# EAGLE design thermostat (EAGLE 7.2.0)
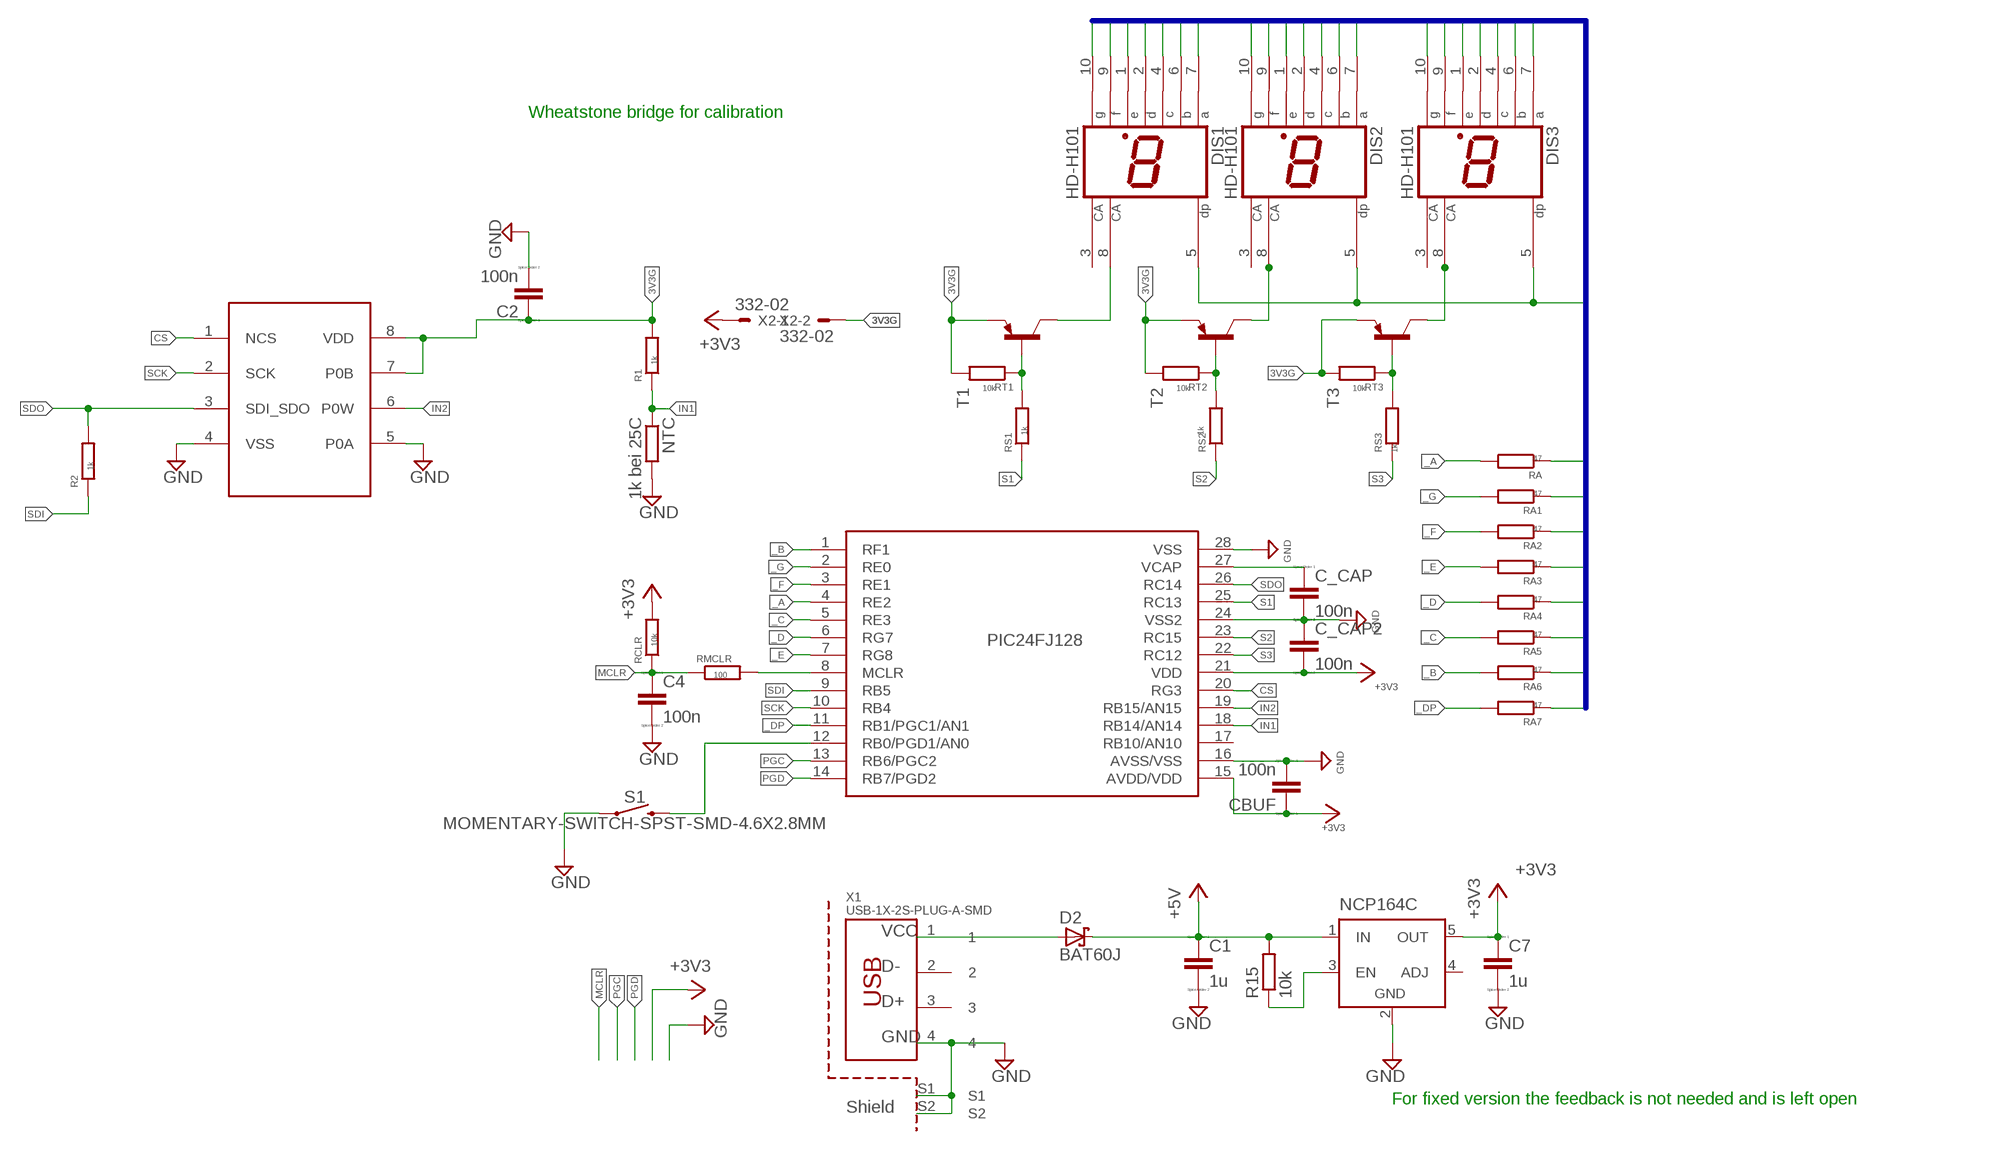
[diagram p0: schematic, sheet 1]

## Parts
C1  1u  CC0603  [C0603]
C2  100n  CC0603  [C0603]
C4  100n  CC0603  [C0603]
C7  1u  CC0603  [C0603]
C_CAP  100n  CC0603  [C0603]
C_CAP2  100n  CC0603  [C0603]
CBUF  100n  CC0603  [C0603]
D2  BAT60J  [SOD323_ST]
DIS1  HD-H101  [HDSP-M]
DIS2  HD-H101  [HDSP-M]
DIS3  HD-H101  [HDSP-M]
NCP164C  -  NCP164C-5V-3.3V  [TSOP-5]
NTC  1k bei 25C  R-EU_0204/2V  [0204V]
R1  1k  R-EU_R0603  [R0603]
R2  1k  R-EU_R0603  [R0603]
R15  10k  R-EU_R0603  [R0603]
RA  47  R-EU_R0603  [R0603]
RA1  47  R-EU_R0603  [R0603]
RA2  47  R-EU_R0603  [R0603]
RA3  47  R-EU_R0603  [R0603]
RA4  47  R-EU_R0603  [R0603]
RA5  47  R-EU_R0603  [R0603]
RA6  47  R-EU_R0603  [R0603]
RA7  47  R-EU_R0603  [R0603]
RCLR  10k  R-EU_R0603  [R0603]
RMCLR  100  R-EU_R0603  [R0603]
RS1  1k  R-EU_R0603  [R0603]
RS2  1k  R-EU_R0603  [R0603]
RS3  1k  R-EU_R0603  [R0603]
RT1  10k  R-EU_R0603  [R0603]
RT2  10k  R-EU_R0603  [R0603]
RT3  10k  R-EU_R0603  [R0603]
S1  MOMENTARY-SWITCH-SPST-SMD-4.6X2.8MM  [TACTILE_SWITCH_SMD_4.6X2.8MM]
T1  -PNP-SOT23-BCE  [SOT23-BCE]
T2  -PNP-SOT23-BCE  [SOT23-BCE]
T3  -PNP-SOT23-BCE  [SOT23-BCE]
U$1  MCP4151  [SO-08]
U$2  -  PIC24FJ128  [SSOP28]
X1  USB-1X-2S-PLUG-A-SMD  [USB-PLUG-A-SMD-2S]
X2  332-02  [332-02]

## Nets
3V3G: C2.1 R1.2 RT1.2 RT2.2 RT3.2 T1.E T2.E T3.E U$1.7(P0B) U$1.8(VDD) X2.2
+3V3: C7.1 C_CAP2.2 CBUF.1 NCP164C.5(OUT) RCLR.2 U$2.15(AVDD/VDD) U$2.21(VDD) X2.1
+5V: C1.1 D2.C NCP164C.1(IN) R15.2
_A: RA.2 U$2.4(RE2)
_B: RA6.2 U$2.1(RF1)
_C: RA5.2 U$2.5(RE3)
_D: RA4.2 U$2.6(RG7)
_DP: RA7.2 U$2.11(RB1/PGC1/AN1)
_E: RA3.2 U$2.7(RG8)
_F: RA2.2 U$2.3(RE1)
_G: RA1.2 U$2.2(RE0)
A: DIS1.7(A) DIS2.7(A) DIS3.7(A) RA.1
B: DIS1.6(B) DIS2.6(B) DIS3.6(B) RA6.1
C: DIS1.4(C) DIS2.4(C) DIS3.4(C) RA5.1
CS: U$1.1(NCS) U$2.20(RG3)
D: DIS1.2(D) DIS2.2(D) DIS3.2(D) RA4.1
DP: DIS1.5(DP) DIS2.5(DP) DIS3.5(DP) RA7.1
E: DIS1.1(E) DIS2.1(E) DIS3.1(E) RA3.1
F: DIS1.9(F) DIS2.9(F) DIS3.9(F) RA2.1
G: DIS1.10(G) DIS2.10(G) DIS3.10(G) RA1.1
GND: C1.2 C2.2 C4.2 C7.2 C_CAP2.1 C_CAP.2 CBUF.2 NCP164C.2(GND) NTC.2 S1.1 S1.2 U$1.4(VSS) U$1.5(P0A) U$2.16(AVSS/VSS) U$2.24(VSS2) U$2.28(VSS) X1.4 X1.S1 X1.S2
IN1: NTC.1 R1.1 U$2.18(RB14/AN14)
IN2: U$1.6(P0W) U$2.19(RB15/AN15)
MCLR: C4.1 RCLR.1 RMCLR.1
N$1: NCP164C.3(EN) R15.1
N$4: C_CAP.1 U$2.27(VCAP)
N$5: RS1.2 RT1.1 T1.B
N$6: D2.A X1.1
N$8: RMCLR.2 U$2.8(MCLR)
N$12: RS3.2 RT3.1 T3.B
N$14: RS2.2 RT2.1 T2.B
N$16: DIS1.8(CA) T1.C
N$17: DIS2.8(CA) T2.C
N$18: DIS3.8(CA) T3.C
N$30: S1.3 S1.4 U$2.12(RB0/PGD1/AN0)
PGC: U$2.13(RB6/PGC2)
PGD: U$2.14(RB7/PGD2)
S1: RS1.1 U$2.25(RC13)
S2: RS2.1 U$2.23(RC15)
S3: RS3.1 U$2.22(RC12)
SCK: U$1.2(SCK) U$2.10(RB4)
SDI: R2.1 U$2.9(RB5)
SDO: R2.2 U$1.3(SDI_SDO) U$2.26(RC14)
Unconnected: DIS1.3(CA) DIS2.3(CA) DIS3.3(CA) NCP164C.4(ADJ) U$2.17(RB10/AN10) X1.2 X1.3

## Buses
A,B,C,D,E,F,G,DP

## Notes on the sheet
- Wheatstone bridge for calibration
- For fixed version the feedback is not needed and is left open

## Library data of the parts
C1 C2 C4 C7 C_CAP C_CAP2 CBUF = eagle-ltspice:C: CAPACITOR, European symbol; SPICEMODEL: NONE; SPICEPREFIX: C
D2 = diode:BAT60J: Schottky barrier diode Source: www.st.com, BAT60J.pdf
DIS1-DIS3 = display-hp:HD-H101: LED DISPLAY 1-character 7 segment, decimal point right; OC_FARNELL: unknown; OC_NEWARK: unknown
NCP164C = linear:NCP164C-5V-3.3V
NTC = resistor:R-EU_: RESISTOR, European symbol
R1 R2 R15 RA RA1-RA7 RCLR RMCLR RS1-RS3 RT1-RT3 = rcl:R-EU_: RESISTOR, European symbol
S1 = SparkFun-Switches:MOMENTARY-SWITCH-SPST: Momentary Switch (Pushbutton) - SPST Normally-open (NO) SPST momentary switches (buttons, pushbuttons). Variants PTH-12MM - 12mm square, through-hole Momentary Pushbutton Switch - 12mm Square <https://www.sparkfun.com/products/9190> (COM-09190) PTH-6.0MM, PTH-6.0MM-KIT - 6.0mm square, through-hole Mini Pushbutton Switch <https://www.sparkfun.com/products/97> (COM-00097) KIT package intended for soldering kit's - only one side of pads' copper is exposed. PTH-RIGHT-ANGLE-KIT - Right-angle, through-hole Right Angle Tactile Button <https://www.sparkfun.com/products/10791> - Used on SparkFun BigTime Watch Kit <https://www.sparkfun.com/products/11734> SMD-12MM - 12mm square, surface-mount Tactile Button - SMD (12mm) <https://www.sparkfun.com/products/12993> (COM-12993) Used on SparkFun PicoBoard <https://www.sparkfun.com/products/11888> SMD-4.5MM - 4.5mm Square Trackball Switch Used on SparkFun Blackberry Trackballer Breakout <https://www.sparkfun.com/products/13169> SMD-4.6MMX2.8MM - 4.60mm x 2.80mm, surface mount Used on SparkFun Pro Micro - RP2040 <https://www.sparkfun.com/products/17717> SMD-5.2MM, SMD-5.2-REDUNDANT - 5.2mm square, surface-mount Mini Pushbutton Switch - SMD <https://www.sparkfun.com/products/8720> (COM-08720) Used on Arduino Pro Mini <https://www.sparkfun.com/products/11114> REDUNDANT package connects both switch circuits together SMD-6.0X3.5MM - 6.0 x 3.5mm, surface mount Momentary Reset Switch SMD <https://www.sparkfun.com/products/8229> (COM-08229) SMD-6.2MM-TALL - 6.2mm square, surface mount Tactile Button - SMD (6mm) <https://www.sparkfun.com/products/12992> Used on SparkFun Digital Sandbox <https://www.sparkfun.com/products/12651> SMD-RIGHT-ANGLE - Right-angle, surface mount Used on SparkFun Block for Intel® Edison - Arduino <https://www.sparkfun.com/products/13036>; PROD_ID: SWCH-15606
T1-T3 = transistor:*-PNP-: PNP Transistror
U$1 = microchip:MCP4151
U$2 = microchip:PIC24FJ128
X1 = _con-usb:USB-1X-2S
X2 = con-garry:332-02: 2 Pin - 2mm Dual Row Source: www.mpe-connector.de / garry_shortform_2012.pdf

## Module PIC24
Ports: 

### Library data of the parts

## Board
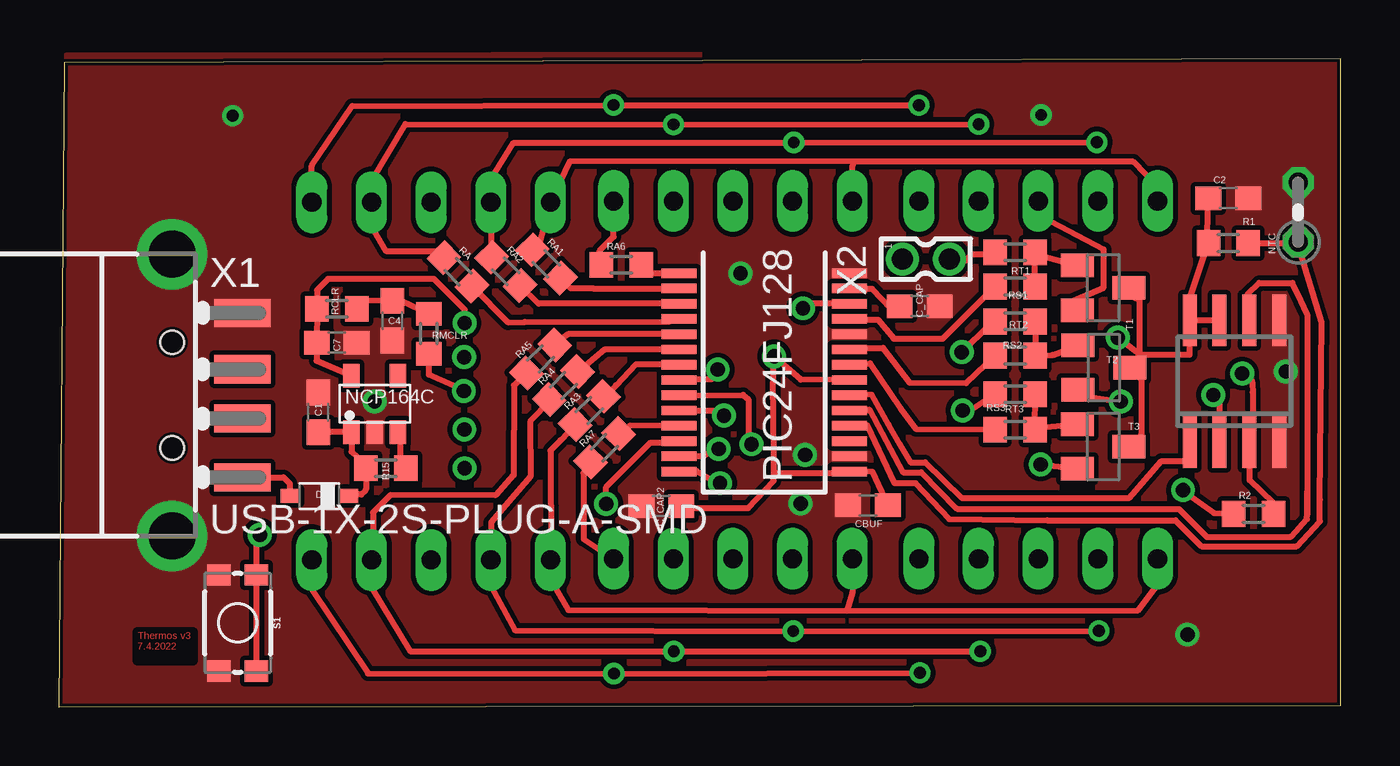
[diagram p1: board, top side]
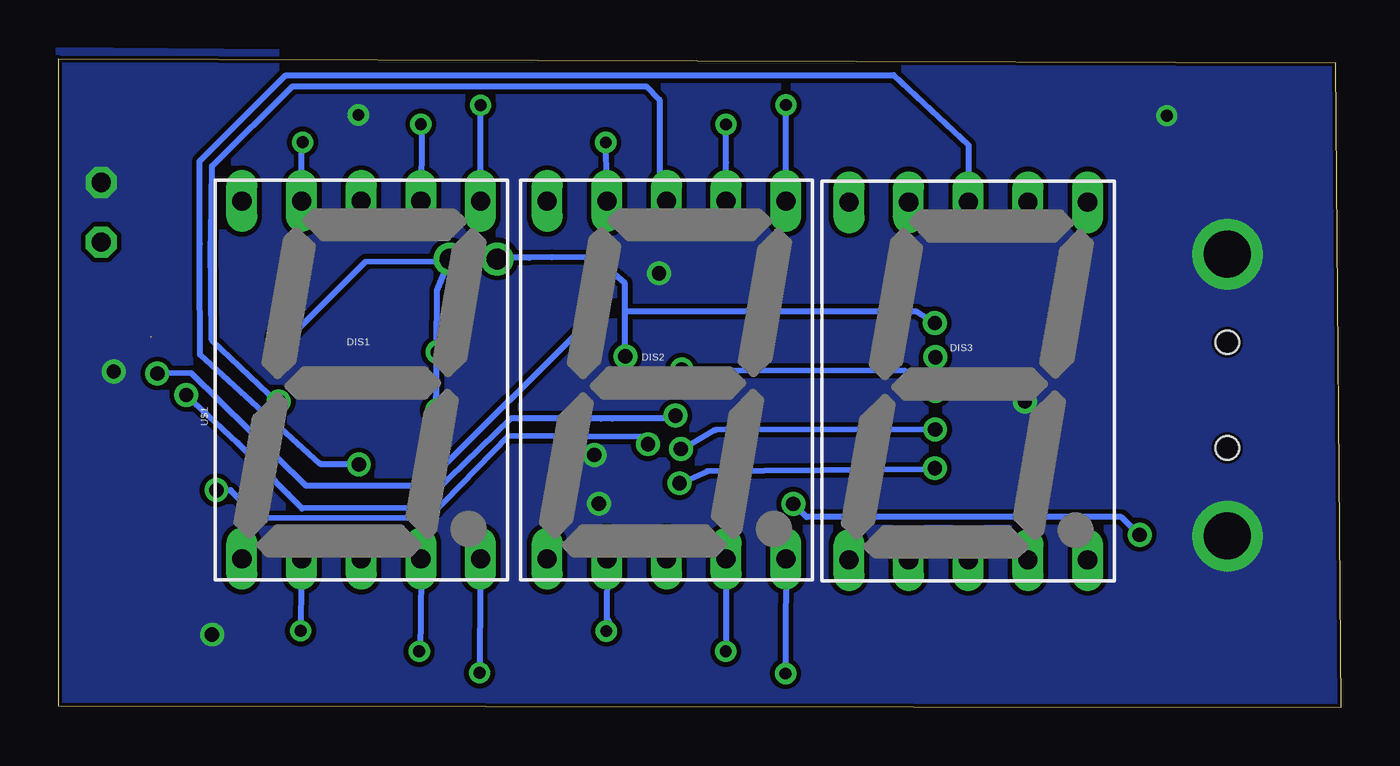
[diagram p2: board, bottom side, seen from below]

Size 54.59 x 27.62 mm. Coordinates in mm from the lower left corner, seen from the top.
Outline: 54.59,0.05 54.59,27.62 0.23,27.44 0,0 54.59,0.05
Copper layers (1*16): Top 0.035mm / dielectric 0.3mm / Bottom 0.035mm
Design rules "default *": minimum track width 10mil, minimum drill 24mil, track to track 8mil, track to pad 8mil, pad to pad 8mil, via to via 8mil, smd to smd 8mil, copper to edge 6mil, drill to drill 8mil, minimum pad ring 10mil, minimum via ring 8mil, stop-mask expansion 3mil, vias tented up to drill 0mil, thermal gap 10mil

### Footprints (pad centres in the part's own frame; a part is rotated, then mirrored left to right if it is on the bottom)
C0603 = smd 1.1 x 1: 1 -0.85,0; 2 0.85,0
SOD323_ST = smd 0.8 x 0.6: A 1.25,0; C -1.25,0
HDSP-M = drill 0.813 long: 1 -5.08,-7.62; 2 -2.54,-7.62; 3 0,-7.62; 4 2.54,-7.62; 5 5.08,-7.62; 6 5.08,7.62; 7 2.54,7.62; 8 0,7.62; 9 -2.54,7.62; 10 -5.08,7.62
TSOP-5 = smd 0.7 x 1: 1 -0.99,-1.2; 2 0,-1.2; 3 0.99,-1.2; 4 0.99,1.2; 5 -0.99,1.2
0204V = drill 0.813 octagon: 1 -1.27,0; 2 1.27,0
R0603 = smd 1 x 1.1: 1 -0.85,0; 2 0.85,0
TACTILE_SWITCH_SMD_4.6X2.8MM = smd 0.9 x 1: 1 -2.05,-0.8; 2 2.05,-0.8; 3 2.05,0.8; 4 -2.05,0.8
SOT23-BCE = smd 1 x 1.4: B -0.95,-1.1; C 0.95,-1.1; E 0,1.1
SO-08 = smd 0.6 x 2.2: 1 -1.905,-2.6; 2 -0.635,-2.6; 3 0.635,-2.6; 4 1.905,-2.6; 5 1.905,2.6; 6 0.635,2.6; 7 -0.635,2.6; 8 -1.905,2.6
SSOP28 = smd 0.4 x 1.5: 1 -4.225,-3.625; 2 -3.575,-3.625; 3 -2.925,-3.625; 4 -2.275,-3.625; 5 -1.625,-3.625; 6 -0.975,-3.625; 7 -0.325,-3.625; 8 0.325,-3.625; 9 0.975,-3.625; 10 1.625,-3.625; 11 2.275,-3.625; 12 2.925,-3.625; 13 3.575,-3.625; 14 4.225,-3.625; 15 4.225,3.625; 16 3.575,3.625; 17 2.925,3.625; 18 2.275,3.625; 19 1.625,3.625; 20 0.975,3.625; 21 0.325,3.625; 22 -0.325,3.625; 23 -0.975,3.625; 24 -1.625,3.625; 25 -2.275,3.625; 26 -2.925,3.625; 27 -3.575,3.625; 28 -4.225,3.625
USB-PLUG-A-SMD-2S = smd 2.4 x 1.2: 1 10.9,-3.6; 2 10.9,-1.1; 3 10.9,1; 4 10.9,3.4 | drill 2: S1 7.9,-6.1; S2 7.9,5.9 | hole 1: 7.9,-2.35; 7.9,2.15
332-02 = drill 0.9 pad 1.27: 1 0,-1; 2 0,1

### Placement (x,y rotation side)
C1  11.05,12.56 90 top
C2  49.8,21.67 0 top
C4  14.2,16.46 270 top
C7  11.84,15.53 0 top
C_CAP  36.66,17.07 0 top
C_CAP2  25.66,8.56 0 top
CBUF  34.46,8.6 180 top
D2  11.1,8.99 180 top
DIS1  41.71,13.94 0 bottom
DIS2  28.71,13.94 0 bottom
DIS3  15.86,13.89 0 bottom
NCP164C  13.46,12.92 0 top
NTC  52.78,21.08 90 top
R1  49.8,19.77 180 top
R2  50.87,8.23 0 top
R15  13.93,10.18 180 top
RA  17,18.54 315 top
RA1  20.76,18.88 315 top
RA2  19.04,18.56 315 top
RA3  22.59,12.64 45 top
RA4  21.49,13.7 45 top
RA5  20.52,14.83 45 top
RA6  23.96,18.84 0 top
RA7  23.24,11.05 45 top
RCLR  11.85,16.97 180 top
RMCLR  15.76,15.91 270 top
RS1  40.72,17.91 0 top
RS2  40.73,14.98 0 top
RS3  40.72,11.82 0 top
RT1  40.72,19.37 180 top
RT2  40.72,16.43 180 top
RT3  40.73,13.33 180 top
S1  7.62,3.59 270 top
T1  44.47,17.86 270 top
T2  44.5,14.46 270 top
T3  44.47,11.1 270 top
U$1  50.06,13.88 0 top
U$2  30.04,14.26 270 top
X1  -3.07,13.39 0 top
X2  36.92,19.09 270 top

### Tracks (layer width: path | path; a pad name or v marks a point on that pad's centre or on a via)
3V3G  (via drill 0.61)
  Top 0.254: T1.E 45.08,17.76 46.02,17.35 46.02,14.88 T2.E | T2.E 45.6,14.44 46.09,13.95 46.09,11.62 T3.E | X2.2 38.59,19.01 38.88,19.3 39.8,19.3 RT1.2 | T2.E 46.03,15.01 | 46.03,15.01 v45.1,15.74 | 45.6,14.35 T2.E | 46.03,15.01 48.16,15.01 U$1.8 | U$1.8 48.16,17.4 R1.2 48.88,19.43 C2.1 | U$1.8 U$1.7 | RT2.2 39.62,16.27 v38.45,15.12 | RT3.2 38.61,12.49 v38.49,12.64
  Bottom 0.254: v45.1,15.74 45.13,15.77 44.73,15.77 41.53,18.97 37.94,19 X2.2 38.48,17.75 38.49,15.2 38.58,15.39 v38.45,15.12 38.5,15.38 38.5,12.78 38.52,13.28 v38.49,12.64
+3V3  (via drill 0.61)
  Top 0.254: NCP164C.5 10.98,14.76 C7.1 RCLR.2 11,17.76 11.47,18.24 15.98,18.24 17.29,16.93 v17.28,16.36 | U$2.15 33.69,9.99 | U$2.21 31.59,13.96 v30.46,14.94 30.42,14.94 30.42,13.86 30.45,10.79 30.45,9.95 | U$2.15 33.63,9.98 | CBUF.1 34.64,10.03 U$2.15 | U$2.15 33.52,9.95 30.45,9.95 | C_CAP2.2 26.28,8.48 29.35,8.48 30.44,9.64 30.45,9.95
  Bottom 0.254: 30.63,14.81 30.63,14.68 v30.46,14.94 arc90 30.48,14.79 30.48,16.85 | v17.28,16.36 18.05,16.85 30.48,16.85 | 30.48,16.85 30.48,18.06 31.76,19.15 33.59,19.16 34.56,19.14 35.52,19.14 X2.1
+5V
  Top 0.254: C1.1 10.96,11.72 NCP164C.1 12.47,10.88 12.7,10.65 12.71,10.65 12.8,10.56 13.21,10.56 R15.2 13.08,9.27 13.06,9.25 13.06,9.24 12.88,9.06 12.42,9.06 D2.C
_A
  Top 0.254: U$2.4 25.97,16.42 19.85,16.41 19.8,16.4 19.14,16.39 RA.2
_B
  Top 0.254: RA6.2 25.02,18.49 U$2.1
_C
  Top 0.254: U$2.5 21.7,15.89 21.25,15.57 RA5.2
_D
  Top 0.254: U$2.6 26.25,15.25 23.27,15.25 22.04,14.24 21.68,14.25 RA4.2
_DP
  Top 0.254: U$2.11 24.32,12 24.02,11.64 RA7.2
_E
  Top 0.254: 26.25,14.58 U$2.7 26.14,14.61 24.59,14.61 23.72,13.71 23.05,13.04 RA3.2
_F
  Top 0.254: U$2.3 20.63,17.19 20.44,17.19 RA2.2
_G
  Top 0.254: U$2.2 22.76,17.84 21.8,17.84 RA1.2
A  (via drill 0.5)
  Top 0.254: v39.17,24.83 v26.18,24.82 14.77,24.84 13.32,22.4 DIS3.7 13.28,20.56 13.93,19.43 16.09,19.43 RA.1 16.72,19.1 16.14,19.43
  Bottom 0.254: v39.17,24.83 39.14,24.56 DIS1.7 | DIS2.7 26.17,23.2 v26.18,24.82
B  (via drill 0.5)
  Top 0.254: DIS3.6 10.78,23.06 12.5,25.6 v23.62,25.65 v36.63,25.64 | 23.67,21.58 DIS2.6 23.63,20.04 23.03,19.44 23.03,18.83 RA6.1
  Bottom 0.254: DIS1.6 v36.63,25.64 | v23.62,25.65 23.63,24.51 DIS2.6 23.63,21.26
C  (via drill 0.5)
  Top 0.254: v39.24,2.38 v26.19,2.38 14.97,2.38 13.32,5.08 DIS3.4 13.39,6.34 13.38,8.29 14.13,9.04 18.6,9.02 19.37,9.89 19.38,13.71 RA5.1
  Bottom 0.254: DIS1.4 39.18,3.26 v39.24,2.38 | DIS2.4 26.17,3.02 v26.19,2.38
CS
  Top 0.254: U$2.20 33.79,13.33 34.61,13.31 35.33,12.02 35.82,11.17 36.27,10.43 36.89,10.43 38.44,8.92 45.51,8.91 45.59,8.92 46.95,10.48 47.99,10.48 47.99,11.12 U$1.1
D  (via drill 0.5)
  Top 0.254: 44.31,3.4 v44.29,3.25 v31.27,3.24 19.43,3.28 18.4,5.15 DIS3.2 18.42,7.87 19.16,8.75 20.09,9.82 20.07,12.16 20.91,13.04 20.95,13.2 RA4.1
  Bottom 0.254: DIS1.2 44.28,3.68 v44.29,3.25 | 31.19,3.71 v31.27,3.24 31.26,3.6 DIS2.2
DP  (via drill 0.5)
  Top 0.254: 23.65,6.79 DIS2.5 | v36.67,1.46 v23.64,1.43 13.17,1.44 10.78,5.02 DIS3.5 10.72,6.33 | 23.57,6.38 DIS2.5 | RA7.1 22.34,9.97 22.35,7.16 DIS2.5
  Bottom 0.254: DIS1.5 36.66,2.37 v36.67,1.46 | DIS2.5 23.64,2.53 v23.64,1.43
E
  Top 0.254: 20.96,6.29 DIS3.1 20.96,6.32 | 20.96,6.32 20.94,10.93 21.36,11.36 22.06,12.08 RA3.1 | 20.96,6.32 21,5.32 21.69,4.14 33.56,4.11 | 33.56,4.11 45.96,4.13 46.85,5.29 46.39,5.92 DIS1.1 | DIS2.1 33.79,4.88 33.56,4.11
F  (via drill 0.5)
  Top 0.254: 44.26,23.89 v44.2,24.06 v31.3,24.05 19.37,24.04 18.4,22.48 DIS3.9 18.44,20.68 18.44,20.39 18.43,19.05 18.43,19.03 18.58,19.15 RA2.1
  Bottom 0.254: DIS1.9 44.25,23.88 v44.2,24.06 | DIS2.9 31.25,22.38 v31.3,24.05
G
  Top 0.254: 20.49,19.59 20.54,19.48 | 20.54,19.48 20.41,19.45 DIS3.10 21.78,23.25 33.9,23.24 | DIS1.10 46.79,22.15 45.75,23.23 33.9,23.24 | DIS2.10 33.79,23.04 33.9,23.24 | RA1.1 20.39,19.56 20.54,19.48
  Bottom 0.254: DIS3.10
GND  (via drill 0.5, 0.61)
  other vias: 48.06,3.09 7.41,25.19 13.45,13.02 31.59,8.67 29.03,18.48 41.83,25.23 31.78,10.74 52.25,14.3
  pour Bottom (no thermals): 0.47,27.43 54.63,27.92 54.41,-0.05 0.06,-0.02
  pour Top (no thermals): 0.32,27.74 54.6,27.81 54.55,0 0.12,0.03
IN1
  Top 0.254: U$2.18 33.53,12.01 34.43,12 35.59,9.55 36.48,9.55 37.92,8.01 42.08,7.96 47.55,7.96 48.66,6.85 52.71,6.85 53.7,7.92 53.7,8.83 53.78,16.38 52.79,19.65 52.96,19.65 52.8,19.81 NTC.1 52.74,19.77 R1.1
IN2  (1 unrouted)
  Top 0.254: U$2.19 33.72,12.72 34.52,12.63 34.52,12.67 | 34.52,12.67 33.8,12.66 | 34.52,12.67 35.95,10 36.73,10 38.25,8.45 40.78,8.44 47.7,8.44 48.89,7.25 52.42,7.25 52.44,7.27 52.48,7.27 53.15,8.01 53.16,8.21 | 50.63,15.82 U$1.6 | 50.68,15.76 50.63,16.43 50.63,17.59 51.11,18.07 52.53,18.07 52.74,17.61 53.17,16.7 53.17,9.22 | 53.16,8.21 53.17,9.22 | 53.17,9.22 53.17,8.27 53.16,8.21
MCLR
  Top 0.254: RCLR.1 13,17.3 C4.1 14.63,17.3 RMCLR.1
N$1
  Top 0.254: NCP164C.3 14.54,11.58 14.54,10.61 14.79,9.96 R15.1
N$4
  Top 0.254: U$2.27 33.51,17.82 34.63,17.82 35.45,16.96 C_CAP.1
N$5
  Top 0.254: RS1.2 RT1.1 41.51,19.31 T1.B
N$6
  Top 0.254: X1.1 9.57,9.79 9.84,9.52 D2.A
N$7
  Top 0.254: 26.78,10.7 27.46,10.7 27.94,11.02
N$8  (via drill 0.61)
  Top 0.254: 17.34,13.5 v17.25,13.47 17.35,13.46 15.76,14.16 15.75,14.77 RMCLR.2 | v28.06,14.38 28.11,14.29 27.78,13.96 26.36,13.96 U$2.8
  Bottom 0.254: v17.25,13.47 17.31,13.55 17.28,13.42 17.64,13.52 18.56,14.33 28.1,14.32 v28.06,14.38
N$11  (via drill 0.61)
  other vias: 17.26,14.91
N$12
  Top 0.254: T3.B 41.56,11.86 RS3.2 41.59,13.37 RT3.1
N$14
  Top 0.254: RS2.2 41.56,14.94 | RT2.1 41.52,16.37 41.58,16.5 RS2.2 | RS2.2 42.33,15 T2.B
N$16
  Top 0.254: T1.C 42.9,17.19 44.5,17.88 44.5,19.49 41.88,20.88 41.88,21.39 DIS1.8
N$17  (via drill 0.61)
  Top 0.254: T2.C 42.86,13.37 v45.22,13.02
  Bottom 0.254: v45.22,13.02 44.88,12.96 45.25,12.96 48.07,15.64 48.11,19.73 48.09,20.02 48.06,23.05 44.63,26.44 29.57,26.44 29.01,25.88 29.01,21.86 DIS2.8
N$18  (via drill 0.61)
  Top 0.254: T3.C 41.78,10.31 v41.81,10.34
  Bottom 0.254: v41.81,10.34 43.43,10.34 43.42,10.36 43.46,10.37 48.57,15.02 48.59,18.74 48.58,19.74 48.59,23.25 44.92,26.91 19.04,26.92 15.85,23.93 DIS3.8
N$21
  Top 0.254: 26.74,10.07 27.15,10.07 27.93,9.62
N$22  (via drill 0.61)
  other vias: 28.16,9.54
N$23  (via drill 0.61)
  other vias: 28.1,11
N$24  (via drill 0.61)
  other vias: 17.27,11.83
N$25  (via drill 0.61)
  other vias: 17.28,10.18
N$26
  Bottom 0.254: 17.32,11.83 26.64,11.8 27.96,11.01
N$27
  Bottom 0.254: 17.23,10.12 26.97,10.05 28.12,9.52
N$30  (via drill 0.61)
  Top 0.254: v8.56,7.34 8.42,7.2 S1.4 S1.3 | v23.31,8.66 23.31,9.38 25.2,11.27 26.35,11.27 U$2.12
  Bottom 0.254: v8.56,7.34 8.56,7.36 8.58,7.38 8.63,7.38 9.35,8.1 22.75,8.1 v23.31,8.66
S1
  Top 0.254: U$2.25 33.53,16.52 34.81,16.51 34.89,16.5 35.56,15.7 37.64,15.7 RS1.1
S2
  Top 0.254: U$2.23 33.61,15.3 35.1,15.3 36.23,13.82 38.64,13.8 RS2.1
S3
  Top 0.254: U$2.22 33.55,14.62 34.55,14.64 35.85,12.73 36.49,11.85 RS3.1
SCK  (via drill 0.61)
  Top 0.254: U$2.10 27.99,12.64 28.34,12.37 v28.33,12.42 | v49.16,13.3 v49.16,13.29 49.42,13.03 U$1.2
  Bottom 0.254: v28.33,12.42 28.55,12.29 | 28.55,12.29 28.57,12.28 | 28.55,12.29 31.02,12.29 31.5,12.29 35.36,12.29 39.29,8.49 44.23,8.46 44.82,9.07 46.97,11.26 v49.16,13.3
SDI  (via drill 0.61)
  Top 0.254: U$2.9 29.14,13.31 29.36,13.11 29.36,11.24 v29.5,11.2 | v47.87,9.25 47.9,9.21 47.88,9.21 49.2,8.27 R2.1
  Bottom 0.254: v29.5,11.2 29.43,11.16 29.23,11.5 35.43,11.55 38.85,8.04 46.12,8.06 46.11,8.06 47.26,9.24 v47.87,9.25 47.29,9.25
SDO  (via drill 0.61)
  Top 0.254: U$2.26 31.93,17.18 v31.69,16.99 | 50.79,13.92 v50.39,14.21 50.69,13.98 50.81,13.9 50.83,13.79 50.84,13.41 50.84,11.43 U$1.3 50.7,9.68 51.71,8.71 R2.2
  Bottom 0.254: v31.69,16.99 31.94,17.19 31.85,17.01 31.77,16.68 39.06,9.43 44.05,9.43 48.94,14.23 v50.39,14.21

### Text on the board
Top: Thermos v3 / 7.4.2022